# EAGLE design blumentopf feuchte messer (EAGLE 6.1)
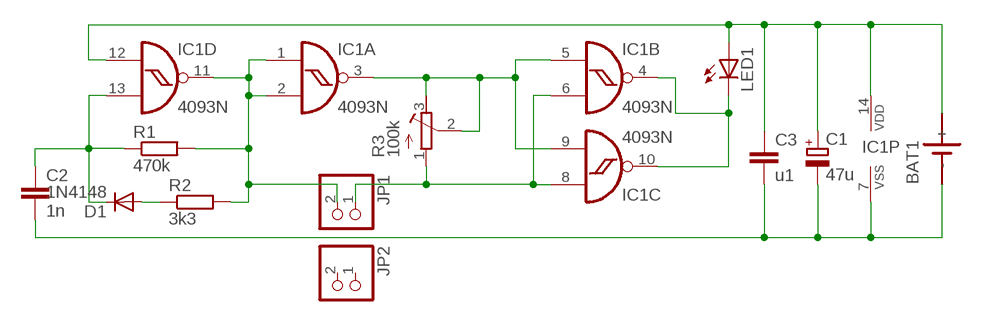
[diagram p0: schematic, sheet 1]

## Parts
BAT1  SN2032  [SN2032]
C1  47u  CPOL-EUE2.5-5  [E2,5-5]
C2  1n  C-EU025-025X050  [C025-025X050]
C3  u1  C-EU025-025X050  [C025-025X050]
D1  1N4148  DIODE-D-2.5  [D-2.5]
IC1  4093N  [DIL14]
JP1  PINHD-1X2  [1X02]
JP2  PINHD-1X2  [1X02]
LED1  LED3MM  [LED3MM]
R1  470k  R-EU_0207/2V  [0207/2V]
R2  3k3  R-EU_0207/2V  [0207/2V]
R3  100k  R-TRIMM64X  [RTRIM64X]

## Nets
A: IC1.6(B:I1) IC1.8(C:I0) JP1.1 R3.1(A)
B: IC1.1(A:I0) IC1.2(A:I1) IC1.11(D:O) JP1.2 R1.2 R2.2
GND: BAT1.- C1.- C2.2 C3.2 IC1.7(P:VSS)
N$1: BAT1.+ C1.+ C3.1 IC1.12(D:I0) IC1.14(P:VDD) LED1.A
N$2: IC1.4(B:O) IC1.10(C:O) LED1.K(C)
N$4: IC1.3(A:O) IC1.5(B:I0) IC1.9(C:I1) R3.2(S) R3.3(E)
N$7: C2.1 D1.C IC1.13(D:I1) R1.1
N$8: D1.A R2.1
Unconnected: JP2.1 JP2.2

## Library data of the parts
BAT1 = sn2032:SN2032: LI BATTERY
C1 = rcl:CPOL-EU: POLARIZED CAPACITOR, European symbol
C2 C3 = rcl:C-EU: CAPACITOR, European symbol
D1 = diode:DIODE-: DIODE
IC1 = 40xx:4093: Quad 2-input NAND schmitt trigger
JP1 JP2 = pinhead:PINHD-1X2: PIN HEADER
LED1 = led:LED: LED OSRAM: - CHIPLED LG R971, LG N971, LY N971, LG Q971, LY Q971, LO R971, LY R971 LH N974, LH R974 LS Q976, LO Q976, LY Q976 LO Q996 - Hyper CHIPLED LW Q18S LB Q993, LB Q99A, LB R99A - SideLED LS A670, LO A670, LY A670, LG A670, LP A670 LB A673, LV A673, LT A673, LW A673 LH A674 LY A675 LS A676, LA A676, LO A676, LY A676, LW A676 LS A679, LY A679, LG A679 - Hyper Micro SIDELED® LS Y876, LA Y876, LO Y876, LY Y876 LT Y87S - SmartLED LW L88C, LW L88S LB L89C, LB L89S, LG L890 LS L89K, LO L89K, LY L89K LS L896, LA L896, LO L896, LY L896 - TOPLED LS T670, LO T670, LY T670, LG T670, LP T670 LSG T670, LSP T670, LSY T670, LOP T670, LYG T670 LG T671, LOG T671, LSG T671 LB T673, LV T673, LT T673, LW T673 LH T674 LS T676, LA T676, LO T676, LY T676, LB T676, LH T676, LSB T676, LW T676 LB T67C, LV T67C, LT T67C, LS T67K, LO T67K, LY T67K, LW E67C LS E67B, LA E67B, LO E67B, LY E67B, LB E67C, LV E67C, LT E67C LW T67C LS T679, LY T679, LG T679 LS T770, LO T770, LY T770, LG T770, LP T770 LB T773, LV T773, LT T773, LW T773 LH T774 LS E675, LA E675, LY E675, LS T675 LS T776, LA T776, LO T776, LY T776, LB T776 LHGB T686 LT T68C, LB T68C - Hyper Mini TOPLED® LB M676 - Mini TOPLED Santana® LG M470 LS M47K, LO M47K, LY M47K Source: http://www.osram.convergy.de LUXEON: - LUMILED® LXK2-PW12-R00, LXK2-PW12-S00, LXK2-PW14-U00, LXK2-PW14-V00 LXK2-PM12-R00, LXK2-PM12-S00, LXK2-PM14-U00 LXK2-PE12-Q00, LXK2-PE12-R00, LXK2-PE12-S00, LXK2-PE14-T00, LXK2-PE14-U00 LXK2-PB12-K00, LXK2-PB12-L00, LXK2-PB12-M00, LXK2-PB14-N00, LXK2-PB14-P00, LXK2-PB14-Q00 LXK2-PR12-L00, LXK2-PR12-M00, LXK2-PR14-Q00, LXK2-PR14-R00 LXK2-PD12-Q00, LXK2-PD12-R00, LXK2-PD12-S00 LXK2-PH12-R00, LXK2-PH12-S00 LXK2-PL12-P00, LXK2-PL12-Q00, LXK2-PL12-R00 Source: www.luxeon.com KINGBRIGHT: KA-3528ASYC Source: www.kingbright.com
R1 R2 = rcl:R-EU_: RESISTOR, European symbol
R3 = rcl:R-TRIMM: Trimm resistor

## Board
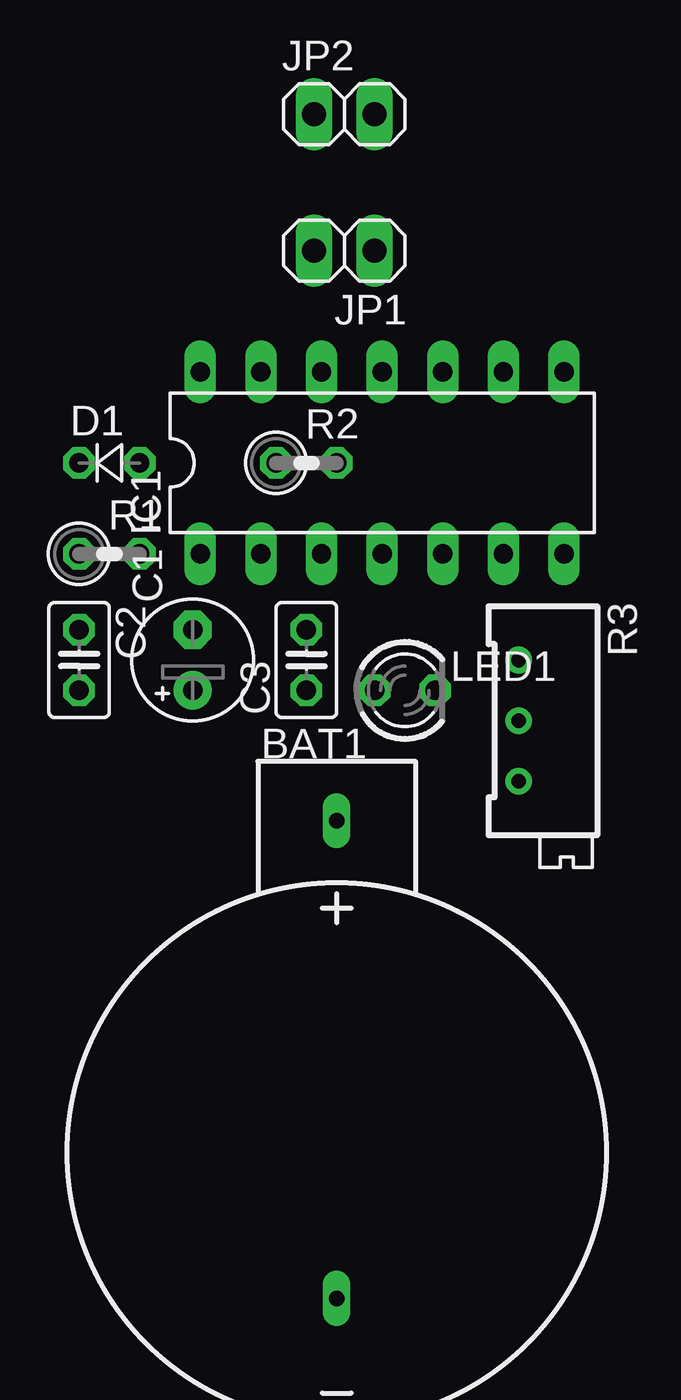
[diagram p1: board, top side]
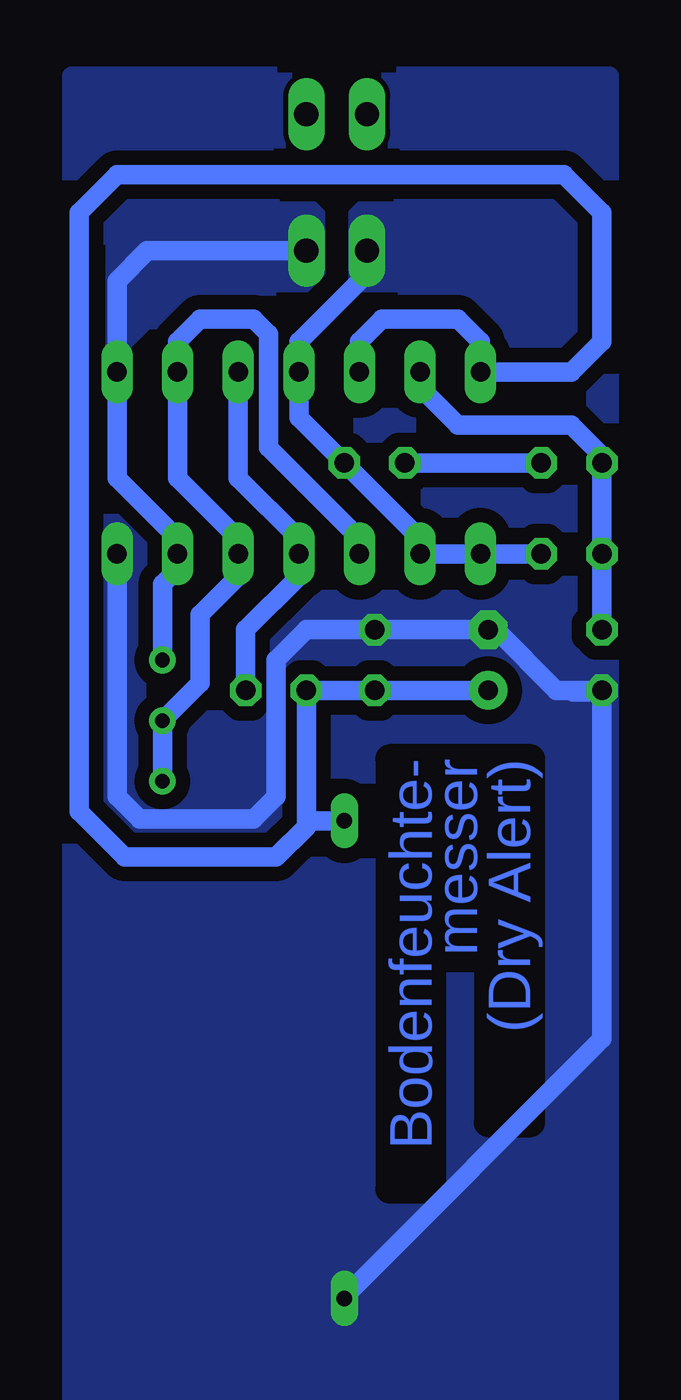
[diagram p2: board, bottom side, seen from below]

No outline drawn. Coordinates in mm, seen from the top.
Copper layers (1*16): Top 0.035mm / dielectric 1.5mm / Bottom 0.035mm
Design rules: minimum track width 10mil, minimum drill 24mil, track to track 8mil, track to pad 8mil, pad to pad 8mil, via to via 8mil, smd to smd 8mil, copper to edge 40mil, drill to drill 8mil, minimum pad ring 10mil, minimum via ring 8mil, stop-mask expansion 4mil, vias tented up to drill 0mil, thermal gap 10mil

### Footprints (pad centres in the part's own frame; a part is rotated, then mirrored left to right if it is on the bottom)
SN2032 = drill 0.65 long: + 0,13.9; - 0,-6.1
E2,5-5 = drill 0.813 pad 1.6: + -1.27,0 | drill 0.813 pad 1.6 octagon: - 1.27,0
C025-025X050 = drill 0.813 octagon: 1 -1.27,0; 2 1.27,0
D-2.5 = drill 0.813 octagon: A 1.27,0; C -1.27,0
DIL14 = drill 0.813 long: 1 -7.62,-3.81; 2 -5.08,-3.81; 3 -2.54,-3.81; 4 0,-3.81; 5 2.54,-3.81; 6 5.08,-3.81; 7 7.62,-3.81; 8 7.62,3.81; 9 5.08,3.81; 10 2.54,3.81; 11 0,3.81; 12 -2.54,3.81; 13 -5.08,3.81; 14 -7.62,3.81
1X02 = drill 1.016 long: 1 -1.27,0; 2 1.27,0
LED3MM = drill 0.813 octagon: A -1.27,0; K 1.27,0
0207/2V = drill 0.813 octagon: 1 -1.27,0; 2 1.27,0
RTRIM64X = drill 0.61: 1 1.27,-2.54; 2 1.27,0; 3 1.27,2.54

### Placement (x,y rotation side)
BAT1  19.37,17.46 0 top
C1  13.34,38.1 90 top
C2  8.57,38.1 270 top
C3  18.1,38.1 90 top
D1  9.84,46.35 0 top
IC1  21.27,46.35 0 top
JP1  19.68,55.24 180 top
JP2  19.68,60.96 0 top
LED1  22.23,36.83 0 top
R1  9.84,42.55 0 top
R2  18.1,46.35 0 top
R3  28.26,35.56 180 top

### Tracks (layer width: path | path; a pad name or v marks a point on that pad's centre or on a via)
A
  Bottom 0.813: R3.1 26.99,41.27 26.35,41.91 IC1.6 26.35,43.18 28.89,45.72 IC1.8 28.89,53.98 27.62,55.24 JP1.1
  pour Bottom (no thermals): 20.32,55.24 20.32,56.83 20.64,57.15 28.26,57.15 29.21,56.2 29.21,51.12 28.57,51.12 26.35,53.34 26.04,53.66 20.95,53.66 20.32,54.29
B
  Bottom 0.813: R1.2 IC1.1 IC1.2 16.19,43.18 R2.2 21.27,48.26 IC1.11 21.27,51.44 18.41,54.29 JP1.2
  pour Bottom (no thermals): 9.84,56.2 10.79,57.15 18.73,57.15 19.05,56.83 19.05,53.66 13.97,53.66 11.75,51.44 10.48,51.44 9.84,52.07
GND
  Bottom 0.813: IC1.7 28.89,32.38 27.94,31.43 23.18,31.43 22.23,32.38 22.23,38.1 20.95,39.37 C3.2 C1.- 13.02,39.37 10.48,36.83 9.84,36.83 | 9.84,36.83 9.78,36.76 8.64,36.76 C2.2 | 9.84,36.83 C2.2 | C2.2 8.57,22.23 19.37,11.43
  pour Bottom (isolate 0.61, no thermals): 8.26,6.35 30.8,6.35 30.8,62.55 8.26,62.55
N$1
  Bottom 0.813: C1.+ C3.1 LED1.A 20.95,31.43 20.95,31.36 | 20.95,31.36 20.95,31.11 22.23,29.84 28.57,29.84 30.48,31.75 30.48,56.83 28.89,58.42 10.16,58.42 8.57,56.83 8.57,51.44 9.84,50.16 IC1.14 13.65,51.44 14.61,52.39 17.78,52.39 18.73,51.44 IC1.12 | BAT1.+ 20.95,31.36
N$2
  Bottom 0.813: IC1.10 23.81,45.72 21.27,43.18 IC1.4 21.27,41.59 23.5,39.37 LED1.K
N$3
  pour Bottom: 19.05,59.69 10.16,59.69 9.53,59.69 8.26,58.42 8.26,61.59 9.21,62.55 18.73,62.55 19.05,62.23
N$4
  Bottom 0.813: IC1.3 18.73,43.18 22.54,46.99 22.54,51.75 23.18,52.39 25.4,52.39 26.35,51.44 IC1.9 26.35,45.72 23.81,43.18 IC1.5 23.81,41.59 25.4,40.01 25.4,37.15 R3.2 R3.3
N$5
  pour Bottom: 20.32,59.69 20.32,62.23 20.64,62.55 29.84,62.55 30.8,61.28 30.8,58.74 30.48,58.74 29.53,59.69
N$7
  Bottom 0.813: C2.1 R1.1 D1.C 8.57,46.67 9.84,47.94 14.61,47.94 16.19,49.53 IC1.13
N$8
  Bottom 0.813: D1.A R2.1

### Text on the board
Bottom: (Dry Alert) | messer | Bodenfeuchte-